# Altium schematic sheet IOConn.SchDoc: I/O Connectors
size A4; Date: 08.04.2017; Author: Jan Petrik; CompanyName: FreeDSP; DrawnBy: Jan Petrik; Organization: FreeDSP; DocumentNumber: 12; Revision: B2; SheetNumber: 12; SheetTotal: 16; Version1: N/A; Version2: N/A; Version3: N/A; Change1description: N/A; Change2description: N/A; Change3description: N/A; Change1DrawnBy: N/A; Change2DrawnBy: N/A; Change3DrawnBy: N/A; Change1CheckedBy: N/A; Change2CheckedBy: N/A; Change3CheckedBy: N/A; PreviusVersion_Chng1: N/A; PreviusVersion_Chng2: N/A; PreviusVersion_Chng3: N/A; Variant1description: Standard assembly; Variant2description: N/A; Variant3description: N/A; Variant4description: N/A; email: jan_petrik@centrum.cz; license: CC BY-NC 4.0
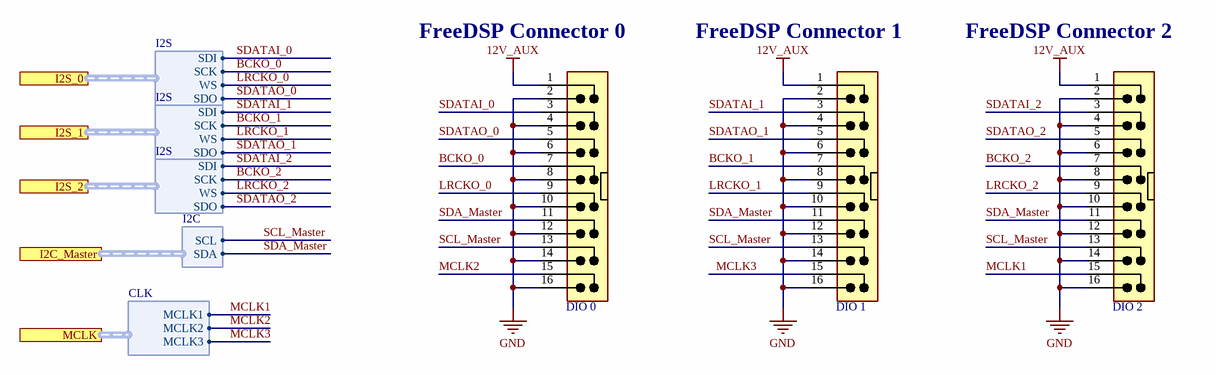
[diagram p0: IOConn.SchDoc]

## Parts
DIO_0  EJ-MLW16G  [MLW16G]  (value not drawn)
DIO_1  EJ-MLW16G  [MLW16G]  (value not drawn)
DIO_2  EJ-MLW16G  [MLW16G]  (value not drawn)

## Ports
I2C_Master (harness I2C), I2S_0 (harness I2S), I2S_1 (harness I2S), I2S_2 (harness I2S), MCLK (harness CLK)

## Harnesses
I2C: SDA, SCL
I2S: SDI, WS, SCK, SDO
CLK: MCLK1, MCLK2, MCLK3

## Nets
12V_AUX: DIO_0.1 DIO_1.1 DIO_2.1
GND: DIO_0.2 DIO_0.4 DIO_0.6 DIO_0.8 DIO_0.10 DIO_0.12 DIO_0.14 DIO_0.16 DIO_1.2 DIO_1.4 DIO_1.6 DIO_1.8 DIO_1.10 DIO_1.12 DIO_1.14 DIO_1.16 DIO_2.2 DIO_2.4 DIO_2.6 DIO_2.8 DIO_2.10 DIO_2.12 DIO_2.14 DIO_2.16
BCKO_0: DIO_0.7 ; port I2S_0.SCK
BCKO_1: DIO_1.7 ; port I2S_1.SCK
BCKO_2: DIO_2.7 ; port I2S_2.SCK
LRCKO_0: DIO_0.9 ; port I2S_0.WS
LRCKO_1: DIO_1.9 ; port I2S_1.WS
LRCKO_2: DIO_2.9 ; port I2S_2.WS
MCLK1: DIO_2.15 ; port MCLK.MCLK1
MCLK2: DIO_0.15 ; port MCLK.MCLK2
MCLK3: DIO_1.15 ; port MCLK.MCLK3
SCL_Master: DIO_0.13 DIO_1.13 DIO_2.13 ; port I2C_Master.SCL
SDA_Master: DIO_0.11 DIO_1.11 DIO_2.11 ; port I2C_Master.SDA
SDATAI_0: DIO_0.3 ; port I2S_0.SDI
SDATAI_1: DIO_1.3 ; port I2S_1.SDI
SDATAI_2: DIO_2.3 ; port I2S_2.SDI
SDATAO_0: DIO_0.5 ; port I2S_0.SDO
SDATAO_1: DIO_1.5 ; port I2S_1.SDO
SDATAO_2: DIO_2.5 ; port I2S_2.SDO

## Notes on the sheet
- (near DIO_0) FreeDSP Connector 0
- (near DIO_1) FreeDSP Connector 1
- (near DIO_2) FreeDSP Connector 2
- Designed by:
- Sheet Title:
- Board Revision:
- License:
- Email:
- www.freedsp.cc
- www.pidsp.com
- Date:
- Sheet:
- /

## Library data of the parts
DIO_0-DIO_2 = MLW 2x8: IDC Male Header for PCB 2x8 Pin, Straight; Author: JM 26.2.2015; SMD: 0; Supplier 1: Mouser; Supplier Part Number 1: 710-61201621621